# Altium schematic sheet Microcontroller.SchDoc: Microcontroller
size Letter; Date: 2017-02-17; Revision: A; SheetNumber: 3; SheetTotal: 11; ProjectTitle: PDUv17: Power Distribution Unit
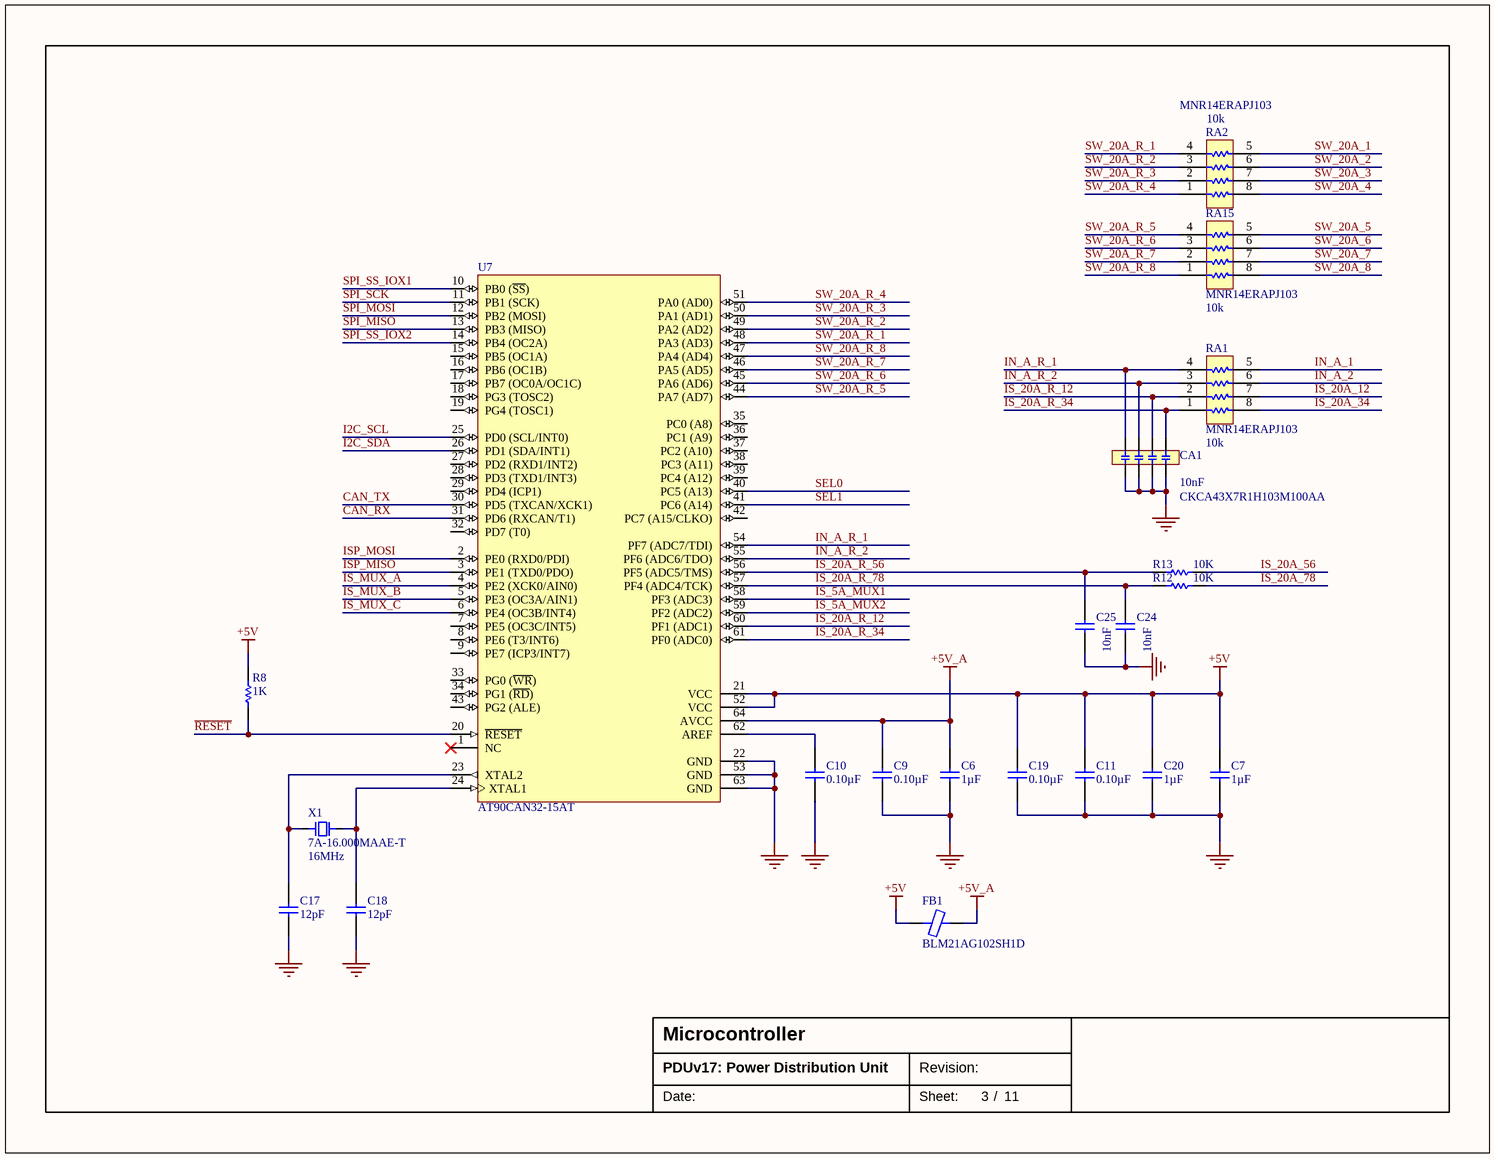
[diagram p0: Microcontroller.SchDoc]

## Parts
C6  value 1µF  [CAP-0805-M]  (hidden comment: CAP 1µF ±10% 16V 0805 X7R)
C7  value 1µF  [CAP-0805-M]  (hidden comment: CAP 1µF ±10% 16V 0805 X7R)
C9  value 0.10µF  [CAP-0402-M]  (hidden comment: CAP 0.10µF ±10% 16V 0402 X7R)
C10  value 0.10µF  [CAP-0402-M]  (hidden comment: CAP 0.10µF ±10% 16V 0402 X7R)
C11  value 0.10µF  [CAP-0402-M]  (hidden comment: CAP 0.10µF ±10% 16V 0402 X7R)
C17  value 12pF  [CAP-0402-M]  (hidden comment: CAP 12pF ±5% 50V 0402 C0G, NP0)
C18  value 12pF  [CAP-0402-M]  (hidden comment: CAP 12pF ±5% 50V 0402 C0G, NP0)
C19  value 0.10µF  [CAP-0402-M]  (hidden comment: CAP 0.10µF ±10% 16V 0402 X7R)
C20  value 1µF  [CAP-0805-M]  (hidden comment: CAP 1µF ±10% 16V 0805 X7R)
C24  value 10nF  [CAP-0402-M]  (hidden comment: CAP 10000pF ±10% 16V 0402 X7R)
C25  value 10nF  [CAP-0402-M]  (hidden comment: CAP 10000pF ±10% 16V 0402 X7R)
CA1  CKCA43X7R1H103M100AA  value 10nF  [CAF-80P319X159-8N]
FB1  BLM21AG102SH1D  [INDC2012X11N]
R8  value 1K  [RES-0603-M]  (hidden comment: RES 1K 1% 1/10 W 0603 ±100ppm/°C)
R12  value 10K  [RES-0603-M]  (hidden comment: RES 10K 1% 1/10 W 0603 ±100ppm/°C)
R13  value 10K  [RES-0603-M]  (hidden comment: RES 10K 1% 1/10 W 0603 ±100ppm/°C)
RA1  MNR14ERAPJ103  value 10k  [CAC-80P319X150-8N]
RA2  MNR14ERAPJ103  value 10k  [CAC-80P319X150-8N]
RA15  MNR14ERAPJ103  value 10k  [CAC-80P319X150-8N]
U7  AT90CAN32-15AT  [TQFP80P1600X1600X120-64N]
X1  7A-16.000MAAE-T  value 16MHz  [QFN200P500X320X135-2N]

## Nets
+5V: C7.1 C11.2 C19.2 C20.1 FB1.1 R8.1 U7.21(VCC) U7.52(VCC)
+5V_A: C6.1 C9.2 FB1.2 U7.64(AVCC)
GND: C6.2 C7.2 C9.1 C10.1 C11.1 C17.1 C18.1 C19.1 C20.2 C24.1 C25.1 CA1.1 CA1.2 CA1.3 CA1.4 U7.22(GND) U7.53(GND) U7.63(GND)
CAN_RX: U7.31(PD6_(RXCAN/T1))
CAN_TX: U7.30(PD5_(TXCAN/XCK1))
I2C_SCL: U7.25(PD0_(SCL/INT0))
I2C_SDA: U7.26(PD1_(SDA/INT1))
IN_A_1: RA1.5
IN_A_2: RA1.6
IN_A_R_1: CA1.5 RA1.4 U7.54(PF7_(ADC7/TDI))
IN_A_R_2: CA1.6 RA1.3 U7.55(PF6_(ADC6/TDO))
IS_5A_MUX1: U7.58(PF3_(ADC3))
IS_5A_MUX2: U7.59(PF2_(ADC2))
IS_20A_12: RA1.7
IS_20A_34: RA1.8
IS_20A_56: R13.1
IS_20A_78: R12.1
IS_20A_R_12: CA1.7 RA1.2 U7.60(PF1_(ADC1))
IS_20A_R_34: CA1.8 RA1.1 U7.61(PF0_(ADC0))
IS_20A_R_56: C25.2 R13.2 U7.56(PF5_(ADC5/TMS))
IS_20A_R_78: C24.2 R12.2 U7.57(PF4_(ADC4/TCK))
IS_MUX_A: U7.4(PE2_(XCK0/AIN0))
IS_MUX_B: U7.5(PE3_(OC3A/AIN1))
IS_MUX_C: U7.6(PE4_(OC3B/INT4))
ISP_MISO: U7.3(PE1_(TXD0/PDO))
ISP_MOSI: U7.2(PE0_(RXD0/PDI))
~{RESET}: R8.2 U7.20(~{RESET})
SEL0: U7.40(PC5_(A13))
SEL1: U7.41(PC6_(A14))
SPI_MISO: U7.13(PB3_(MISO))
SPI_MOSI: U7.12(PB2_(MOSI))
SPI_SCK: U7.11(PB1_(SCK))
SPI_SS_IOX1: U7.10(PB0_(~{SS}))
SPI_SS_IOX2: U7.14(PB4_(OC2A))
SW_20A_1: RA2.5
SW_20A_2: RA2.6
SW_20A_3: RA2.7
SW_20A_4: RA2.8
SW_20A_5: RA15.5
SW_20A_6: RA15.6
SW_20A_7: RA15.7
SW_20A_8: RA15.8
SW_20A_R_1: RA2.4 U7.48(PA3_(AD3))
SW_20A_R_2: RA2.3 U7.49(PA2_(AD2))
SW_20A_R_3: RA2.2 U7.50(PA1_(AD1))
SW_20A_R_4: RA2.1 U7.51(PA0_(AD0))
SW_20A_R_5: RA15.4 U7.44(PA7_(AD7))
SW_20A_R_6: RA15.3 U7.45(PA6_(AD6))
SW_20A_R_7: RA15.2 U7.46(PA5_(AD5))
SW_20A_R_8: RA15.1 U7.47(PA4_(AD4))
NetC10_2: C10.2 U7.62(AREF)
NetC17_2: C17.2 U7.23(XTAL2) X1.1
NetC18_2: C18.2 U7.24(XTAL1) X1.2

Not connected (* = marked no-connect by the designer): U7 1(NC)* 7(PE5_(OC3C/INT5)) 8(PE6_(T3/INT6)) 9(PE7_(ICP3/INT7)) 15(PB5_(OC1A)) 16(PB6_(OC1B)) 17(PB7_(OC0A/OC1C)) 18(PG3_(TOSC2)) 19(PG4_(TOSC1)) 27(PD2_(RXD1/INT2)) 28(PD3_(TXD1/INT3)) 29(PD4_(ICP1)) 32(PD7_(T0)) 33(PG0_(~{WR})) 34(PG1_(~{RD})) 35(PC0_(A8)) 36(PC1_(A9)) 37(PC2_(A10)) 38(PC3_(A11)) 39(PC4_(A12)) 42(PC7_(A15/CLKO)) 43(PG2_(ALE))

## Notes on the sheet
- Date:
- Revision:
- Sheet:
- /

## Library data of the parts
C6 C7 C20 = CC0805KKX7R7BB105: Manufacturer: Yageo; Manufacturer Series: CC; Part Number: CC0805KKX7R7BB105; Component Type: Standard; Tolerance: ±10%; Voltage: 16V; Package: 0805; Temperature Coefficient: X7R; Temperature Range: -55°C ~ 125°C; Supplier 1: Digi-Key; Supplier Part Number 1: 311-1365-1-ND
C9-C11 C19 = CC0402KRX7R7BB104: Manufacturer: Yageo; Manufacturer Series: CC; Part Number: CC0402KRX7R7BB104; Component Type: Standard; Tolerance: ±10%; Voltage: 16V; Package: 0402; Temperature Coefficient: X7R; Temperature Range: -55°C ~ 125°C; Supplier 1: Digi-Key; Supplier Part Number 1: 311-1338-1-ND
C17 C18 = CC0402JRNPO9BN120: Manufacturer: Yageo; Manufacturer Series: CC; Part Number: CC0402JRNPO9BN120; Component Type: Standard; Tolerance: ±5%; Voltage: 50V; Package: 0402; Temperature Coefficient: C0G, NP0; Temperature Range: -55°C ~ 125°C; Supplier 1: Digi-Key; Supplier Part Number 1: 311-1016-1-ND
C24 C25 = CC0402KRX7R7BB103: Manufacturer: Yageo; Manufacturer Series: CC; Part Number: CC0402KRX7R7BB103; Component Type: Standard; Tolerance: ±10%; Voltage: 16V; Package: 0402; Temperature Coefficient: X7R; Temperature Range: -55°C ~ 125°C; Supplier 1: Digi-Key; Supplier Part Number 1: 311-1042-1-ND
R8 = RC0603FR-071KL: Manufacturer: Yageo; Manufacturer Series: RC; Power: 1/10 W; Part Number: RC0603FR-071KL; Component Type: Standard; Tolerance: 1%; Package: 0603; Temperature Coefficient: ±100ppm/°C; Temperature Range: -55°C ~ 155°C; Supplier 1: Digi-Key; Supplier Part Number 1: 311-1.00KHRCT-ND
R12 R13 = RC0603FR-0710KL: Manufacturer: Yageo; Manufacturer Series: RC; Power: 1/10 W; Part Number: RC0603FR-0710KL; Component Type: Standard; Tolerance: 1%; Package: 0603; Temperature Coefficient: ±100ppm/°C; Temperature Range: -55°C ~ 155°C; Supplier 1: Digi-Key; Supplier Part Number 1: 311-10.0KHRCT-ND
X1 = 7A-16.000MAAE-T: SMD Crystal Oscillator 12 pF; Load Capacitance: 12pF; Supplier 1: Digi-Key; Supplier Part Number 1: 887-1747-1-ND
FB1 = BLM21AG102SH1D: Supplier 1: Digi-Key; Supplier Part Number 1: 490-10664-1-ND
U7 = AT90CAN32-15AT: Supplier 1: Digi-Key; Supplier Part Number 1: AT90CAN32-15ATCT-ND